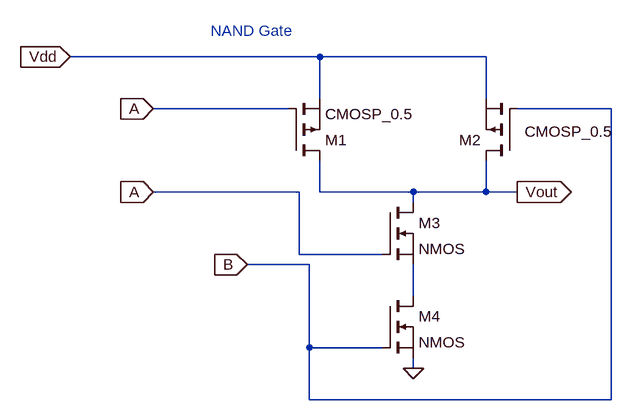
[diagram p0: schematic my_nand.asc]
my_nand.asc, the LTspice schematic file:
Version 4
SHEET 1 932 680
WIRE 480 -16 96 -16
WIRE 736 -16 480 -16
WIRE 480 48 480 -16
WIRE 736 48 736 -16
WIRE 432 64 224 64
WIRE 928 64 784 64
WIRE 448 192 224 192
WIRE 480 192 480 144
WIRE 624 192 480 192
WIRE 736 192 736 144
WIRE 736 192 624 192
WIRE 784 192 736 192
WIRE 624 208 624 192
WIRE 448 288 448 192
WIRE 576 288 448 288
WIRE 464 304 368 304
WIRE 624 352 624 304
WIRE 464 432 464 304
WIRE 576 432 464 432
WIRE 624 464 624 448
WIRE 464 512 464 432
WIRE 928 512 928 64
WIRE 928 512 464 512
FLAG 624 464 0
FLAG 96 -16 Vdd
IOPIN 96 -16 In
FLAG 224 64 A
IOPIN 224 64 In
FLAG 224 192 A
IOPIN 224 192 In
FLAG 368 304 B
IOPIN 368 304 In
FLAG 784 192 Vout
IOPIN 784 192 Out
SYMBOL pmos 432 144 M180
SYMATTR InstName M1
SYMATTR Value CMOSP_0.5
SYMBOL pmos 784 144 R180
WINDOW 3 -11 45 Right 2
SYMATTR Value CMOSP_0.5
SYMATTR InstName M2
SYMBOL nmos 576 208 R0
SYMATTR InstName M3
SYMBOL nmos 576 352 R0
SYMATTR InstName M4
TEXT 312 -56 Left 2 ;NAND Gate

The netlist it stands for:
* my_nand.asc
M1 Vout A Vdd Vdd CMOSP_0.5
M2 Vout B Vdd Vdd CMOSP_0.5
M3 Vout A N001 N001 NMOS
M4 N001 B 0 0 NMOS
.model NMOS NMOS
.model PMOS PMOS
.lib standard.mos
* NAND Gate
.backanno
.end